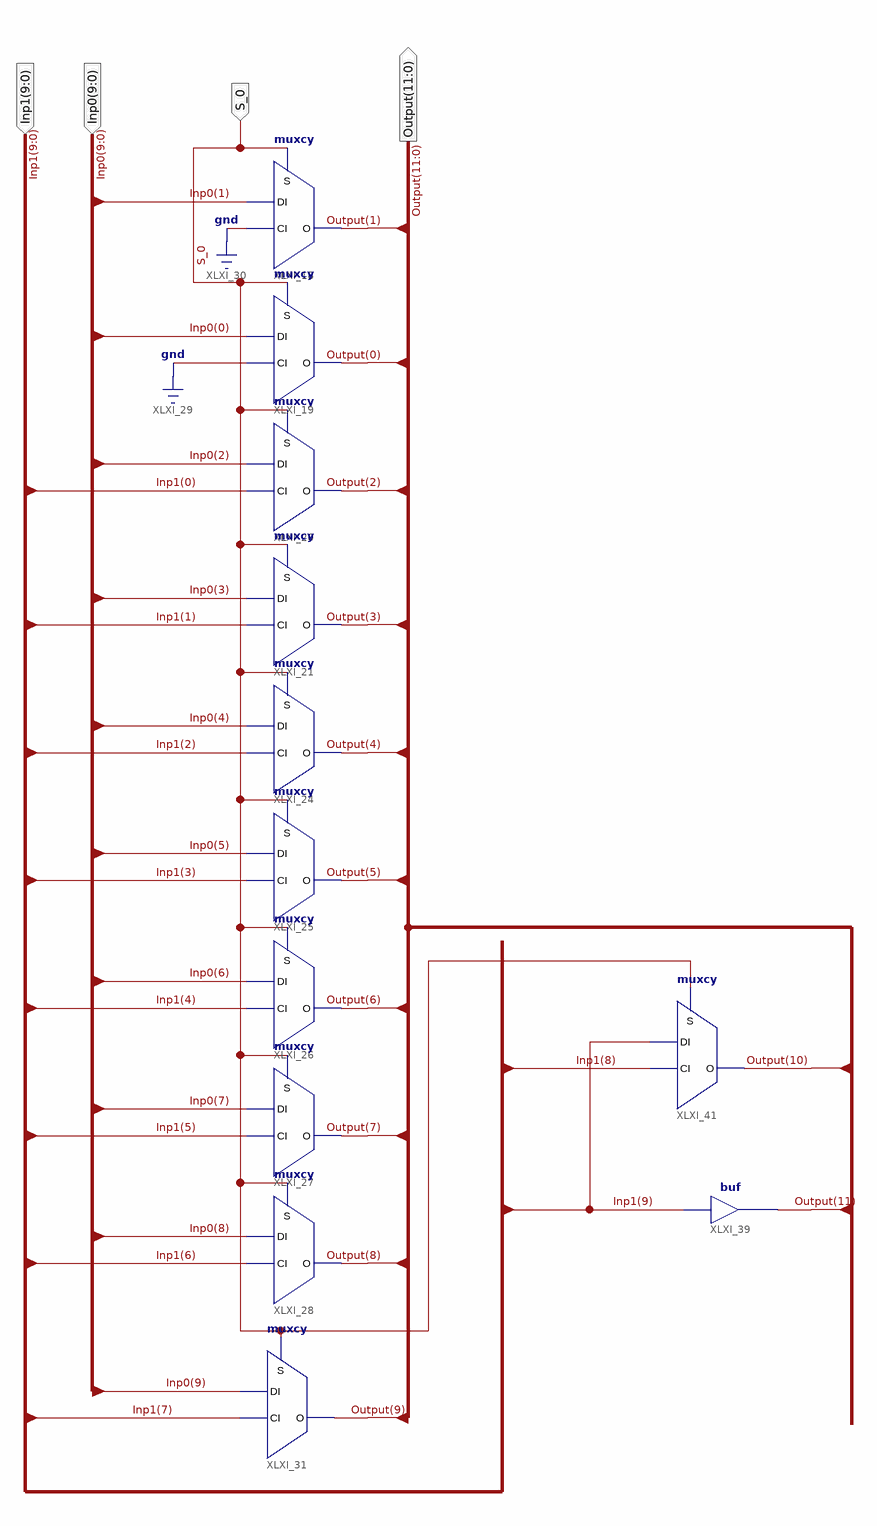
[diagram p0: schematic sheet 1]
// Xilinx ISE schematic Multiplier_4.sch (spartan3e) as structural Verilog: 12 symbols, 4 ports
module Multiplier_4 (
  input  [9:0] Inp1,
  input  [9:0] Inp0,
  input  S_0,
  output [11:0] Output
);

  muxcy XLXI_19 (.CI(1'b0), .DI(Inp0[0]), .S(S_0), .O(Output[0]));
  muxcy XLXI_18 (.CI(1'b0), .DI(Inp0[1]), .S(S_0), .O(Output[1]));
  muxcy XLXI_20 (.CI(Inp1[0]), .DI(Inp0[2]), .S(S_0), .O(Output[2]));
  muxcy XLXI_21 (.CI(Inp1[1]), .DI(Inp0[3]), .S(S_0), .O(Output[3]));
  muxcy XLXI_24 (.CI(Inp1[2]), .DI(Inp0[4]), .S(S_0), .O(Output[4]));
  muxcy XLXI_25 (.CI(Inp1[3]), .DI(Inp0[5]), .S(S_0), .O(Output[5]));
  muxcy XLXI_26 (.CI(Inp1[4]), .DI(Inp0[6]), .S(S_0), .O(Output[6]));
  muxcy XLXI_27 (.CI(Inp1[5]), .DI(Inp0[7]), .S(S_0), .O(Output[7]));
  muxcy XLXI_28 (.CI(Inp1[6]), .DI(Inp0[8]), .S(S_0), .O(Output[8]));
  muxcy XLXI_31 (.CI(Inp1[7]), .DI(Inp0[9]), .S(S_0), .O(Output[9]));
  buf XLXI_39 (Output[11], Inp1[9]);
  muxcy XLXI_41 (.CI(Inp1[8]), .DI(Inp1[9]), .S(S_0), .O(Output[10]));
endmodule
